# EAGLE schematic Communication_Tranceiver_CAN_MAX3051 (EAGLE 6.5.0)
CAN Tranceiver MAX3051 <http://datasheets.maxim-ic.com/en/ds/MAX3051.pdf> Connect CANTXx to an RPx pin. Connect CANRXx to an RPIx pin. This sheet includes a decoupling power capacitor (optional for clean power sources), a slope control resistor (optional for short length wires), and a shutdown pin perminantly connected to on (it has a pulldown, so it is not necessary). The R_RS (kΩ) = 12000 / (maximum speed in kbps) The default R_RS value is 48kΩ for 250 kbps
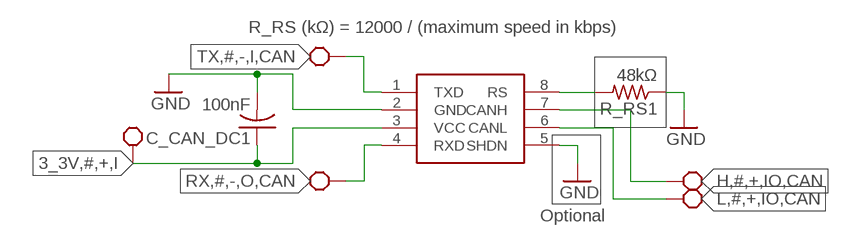
[diagram p0: schematic, sheet 1]

## Parts
C_CAN_DC1  100nF  C-USC0603  [C0603]
CAN_TRAN1  MAX3051  [SOT23-8L]
R_RS1  48kΩ  R-US_R0603  [R0603]

## Nets
3_3V,#,+,I: C_CAN_DC1.1 CAN_TRAN1.3(VCC) ; supply symbol labelled BLOCK_REQUIREMENT
GND: C_CAN_DC1.2 CAN_TRAN1.2(GND) CAN_TRAN1.5(SHDN) R_RS1.1
H,#,+,IO,CAN: CAN_TRAN1.7(CANH) ; supply symbol labelled BLOCK_REQUIREMENT
L,#,+,IO,CAN: CAN_TRAN1.6(CANL) ; supply symbol labelled BLOCK_REQUIREMENT
N$6: CAN_TRAN1.8(RS) R_RS1.2
RX,#,-,O,CAN: CAN_TRAN1.4(RXD) ; supply symbol labelled BLOCK_REQUIREMENT
TX,#,-,I,CAN: CAN_TRAN1.1(TXD) ; supply symbol labelled BLOCK_REQUIREMENT

## Notes on the sheet
- R_RS (kΩ) = 12000 / (maximum speed in kbps)
- Optional

## Library data of the parts
C_CAN_DC1 = resistor:C-US: CAPACITOR, American symbol
CAN_TRAN1 = piccoli:MAX3051
R_RS1 = resistor:R-US_: RESISTOR, American symbol

## Net classes
4 xxwide: width 0.203 mm